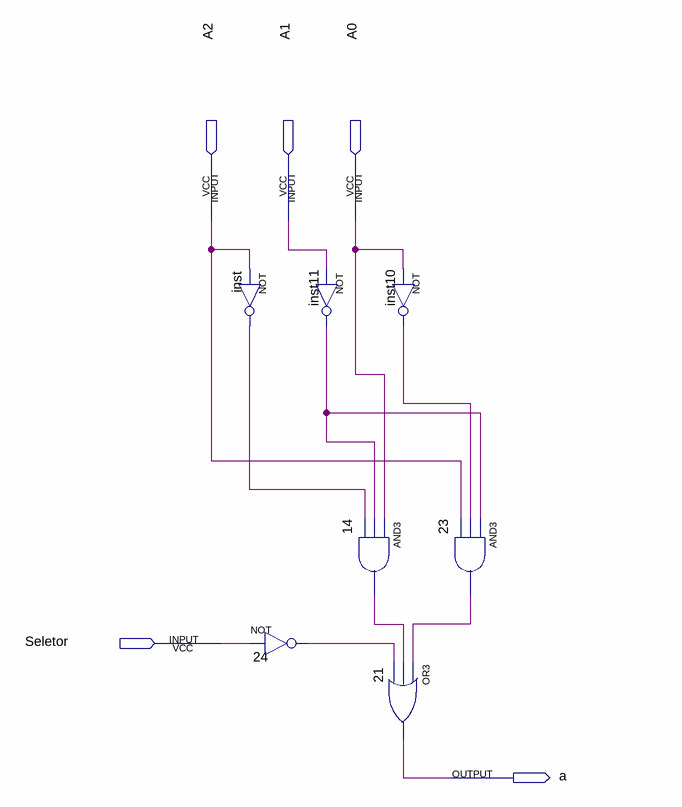
[diagram p0: schematic sheet]
// Quartus schematic segmento_a.bdf as structural Verilog: 7 symbols, 5 pins
module segmento_a (
  input  A2,
  input  A1,
  input  A0,
  input  Seletor,
  output a
);

  wire inst10_out, inst11_out, inst_out, n14_out, n23_out, n24_out;

  not inst (inst_out, A2);
  not u_24 (n24_out, Seletor);
  not inst11 (inst11_out, A1);
  and u_14 (n14_out, A0, inst11_out, inst_out);
  not inst10 (inst10_out, A0);
  and u_23 (n23_out, inst11_out, inst10_out, A2);
  or u_21 (a, n23_out, n14_out, n24_out);
endmodule
